# EAGLE schematic currentlim (EAGLE 9.5.2)
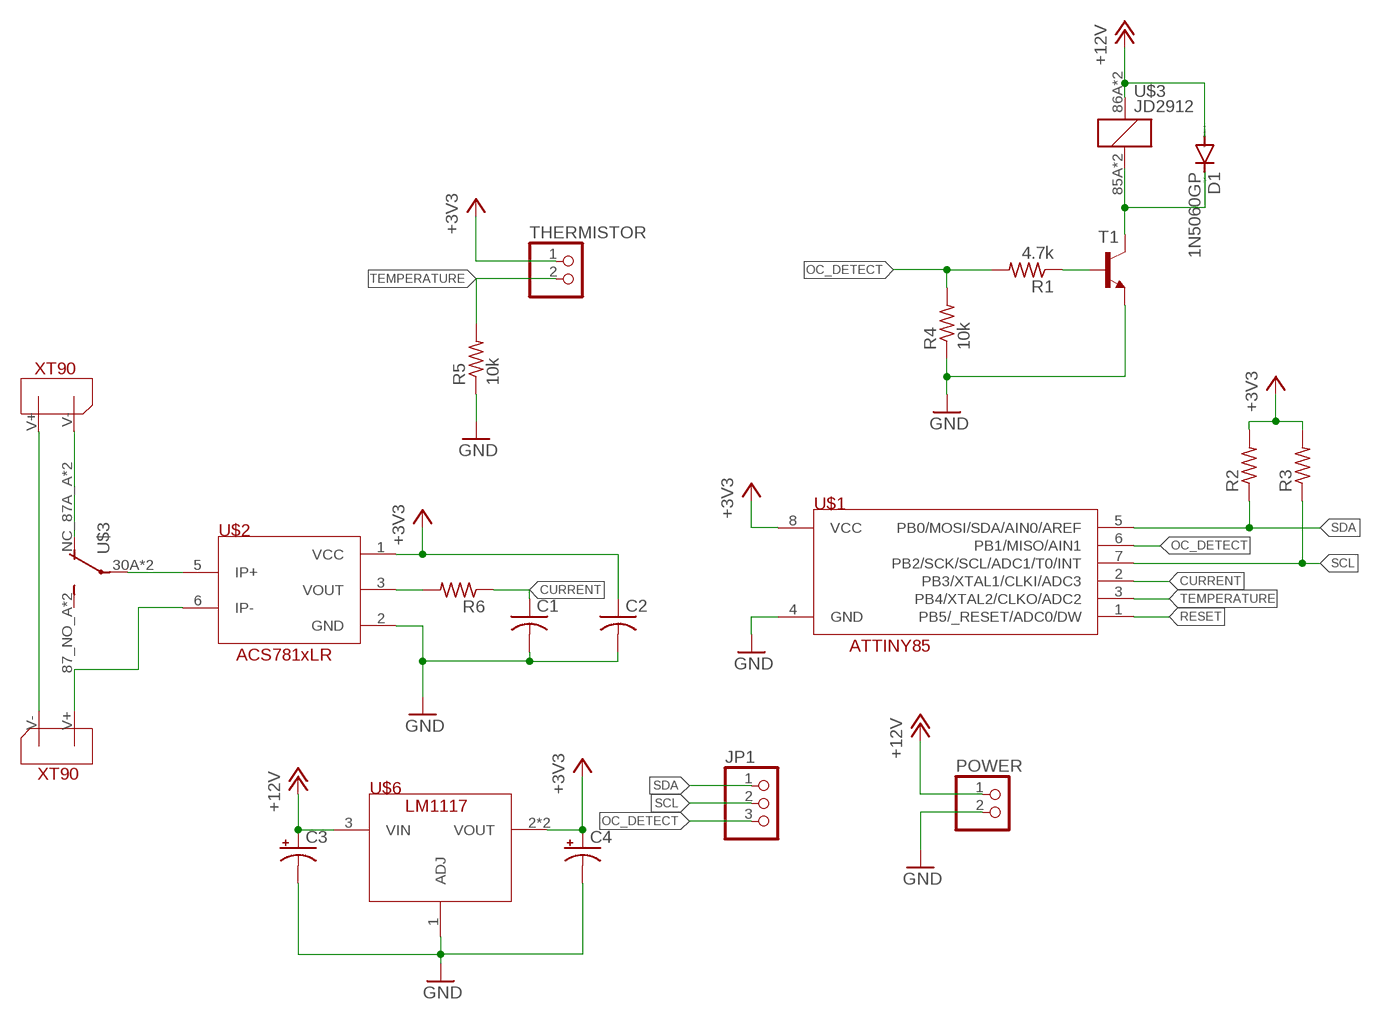
[diagram p0: schematic, sheet 1]

## Parts
C1  C-USC0805  [C0805]
C2  C-USC0805  [C0805]
C3  CPOL-USE2.5-6  [E2,5-6]
C4  CPOL-USE2.5-6  [E2,5-6]
D1  1N5060GP  [DO15-12]
JP1  PINHD-1X3  [1X03]
POWER  PINHD-1X2  [1X02]
R1  4.7k  R-US_M0805  [M0805]
R2  R-US_M0805  [M0805]
R3  R-US_M0805  [M0805]
R4  10k  R-US_M0805  [M0805]
R5  10k  R-US_M0805  [M0805]
R6  R-US_M0805  [M0805]
T1  MPS2222A-NPN-TO92-CBE  [TO92-CBE]
THERMISTOR  PINHD-1X2  [1X02]
U$1  ATTINY85V-10SUR  [SOIC8]
U$2  ACS781LLRTR-050B-T_M  [7-PSOF-EXTENDED]
U$3  JD2912  [JD2912]
U$4  XT90_ST  [XT90_ST]
U$5  XT90_ST  [XT90_ST]
U$6  LM1117MPX-3.3/NOPB  [SOT223]

## Nets
+3V3: C2.1 C4.+ R2.2 R3.2 THERMISTOR.1 U$1.8(VCC) U$2.1(VCC) U$6.2(VOUT) U$6.4(VOUT)
+12V: C3.+ D1.A POWER.1 U$3.86A U$3.86B U$6.3(VIN)
CURRENT: C1.1 R6.1 U$1.2(PB3/XTAL1/CLKI/ADC3)
GND: C1.2 C2.2 C3.- C4.- POWER.2 R4.1 R5.1 T1.E U$1.4(GND) U$2.2(GND) U$6.1(ADJ)
N$1: R1.1 T1.B
N$2: R6.2 U$2.3(VOUT)
N$4: U$2.6(IP-) U$5.V+
N$5: U$2.5(IP+) U$3.30A(P) U$3.30B(P)
N$6: U$3.NC_87A_A(O) U$3.NC_87A_B(O) U$4.V-
N$7: U$4.V+ U$5.V-
N$8: D1.C T1.C U$3.85A U$3.85B
OC_DETECT: JP1.3 R1.2 R4.2 U$1.6(PB1/MISO/AIN1)
RESET: U$1.1(PB5/_RESET/ADC0/DW)
SCL: JP1.2 R3.1 U$1.7(PB2/SCK/SCL/ADC1/T0/INT)
SDA: JP1.1 R2.1 U$1.5(PB0/MOSI/SDA/AIN0/AREF)
TEMPERATURE: R5.2 THERMISTOR.2 U$1.3(PB4/XTAL2/CLKO/ADC2)
Unconnected: U$3.87_NO_A(S) U$3.87_NO_B(S)

## Library data of the parts
C1 C2 = rcl:C-US: CAPACITOR, American symbol; SPICEPREFIX: C
C3 C4 = rcl:CPOL-US: POLARIZED CAPACITOR, American symbol; SPICEPREFIX: C
D1 = diode:1N5060GP: DIODE controlled avalanche rectifier
JP1 = pinhead:PINHD-1X3: PIN HEADER
POWER THERMISTOR = pinhead:PINHD-1X2: PIN HEADER
R1-R6 = rcl:R-US_: RESISTOR, American symbol; SPICEPREFIX: R
T1 = transistor:*-NPN-: NPN Transistror BF959 corrected 2008.03.06
U$1 = currentlim:ATTINY85
U$2 = currentlim:ACS781
U$3 = currentlim:JD2912
U$4 U$5 = XT Connectors:XT90_ST
U$6 = currentlim:LM1117MPX-3.3/NOPB